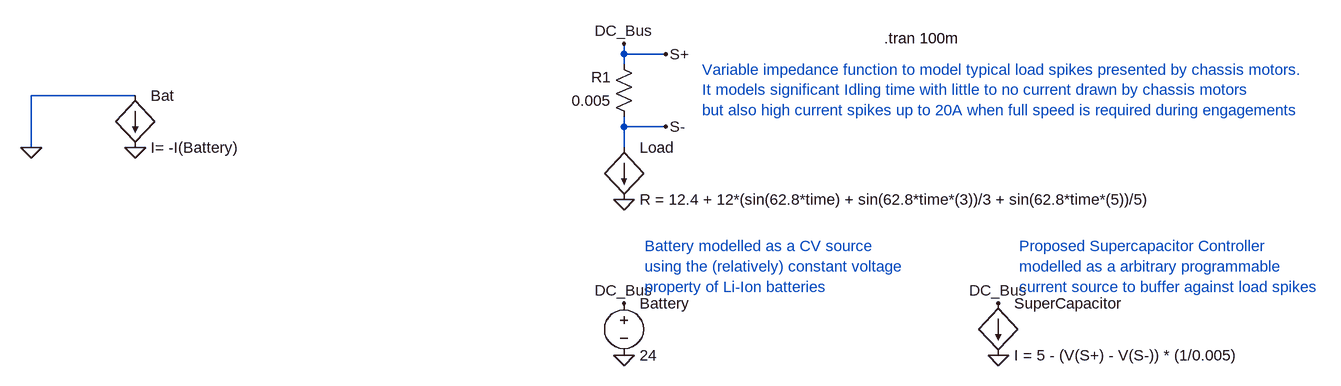
[diagram p0: schematic supercapacitor_overview.asc]
supercapacitor_overview.asc, the LTspice schematic file:
Version 4
SHEET 1 1792 680
WIRE 0 -240 0 -256
WIRE 64 -240 0 -240
WIRE 0 -224 0 -240
WIRE -752 -176 -912 -176
WIRE 0 -128 0 -144
WIRE 64 -128 0 -128
WIRE -912 -96 -912 -176
WIRE 0 -96 0 -128
FLAG 0 224 0
FLAG 576 224 0
FLAG 0 144 DC_Bus
FLAG 576 144 DC_Bus
FLAG 0 -16 0
FLAG 0 -256 DC_Bus
FLAG 64 -240 S+
FLAG 64 -128 S-
FLAG -752 -96 0
FLAG -912 -96 0
SYMBOL voltage 0 128 R0
WINDOW 123 0 0 Left 0
WINDOW 39 0 0 Left 0
SYMATTR InstName Battery
SYMATTR Value 24
SYMBOL bi 576 144 R0
SYMATTR InstName SuperCapacitor
SYMATTR Value I = 5 - (V(S+) - V(S-)) * (1/0.005)
SYMBOL bi 0 -96 R0
SYMATTR InstName Load
SYMATTR Value R = 12.4 + 12*(sin(62.8*time) + sin(62.8*time*(3))/3 + sin(62.8*time*(5))/5)
SYMBOL res 16 -128 R180
WINDOW 0 36 76 Left 2
WINDOW 3 36 40 Left 2
SYMATTR InstName R1
SYMATTR Value 0.005
SYMBOL bi -752 -176 R0
SYMATTR InstName Bat
SYMATTR Value I= -I(Battery)
TEXT 400 -264 Left 2 !.tran 100m
TEXT 120 -216 Left 2 ;Variable impedance function to model typical load spikes presented by chassis motors.\nIt models significant Idling time with little to no current drawn by chassis motors\nbut also high current spikes up to 20A when full speed is required during engagements
TEXT 32 56 Left 2 ;Battery modelled as a CV source \nusing the (relatively) constant voltage \nproperty of Li-Ion batteries
TEXT 608 56 Left 2 ;Proposed Supercapacitor Controller \nmodelled as a arbitrary programmable\ncurrent source to buffer against load spikes

The netlist it stands for:
* supercapacitor_overview.asc
V§Battery S+ 0 24
B§SuperCapacitor S+ 0 I = 5 - (V(S+) - V(S-)) * (1/0.005)
B§Load S- 0 R = 12.4 + 12*(sin(62.8*time) + sin(62.8*time*(3))/3 + sin(62.8*time*(5))/5)
R1 S- S+ 0.005
Bat 0 0 I= -I(Battery)
.tran 100m
* Variable impedance function to model typical load spikes presented by chassis motors.
* It models significant Idling time with little to no current drawn by chassis motors
* but also high current spikes up to 20A when full speed is required during engagements
* Battery modelled as a CV source
* using the (relatively) constant voltage
* property of Li-Ion batteries
* Proposed Supercapacitor Controller
* modelled as a arbitrary programmable
* current source to buffer against load spikes
.backanno
.end